# Altium schematic sheet Buffer.SchDoc
size A4
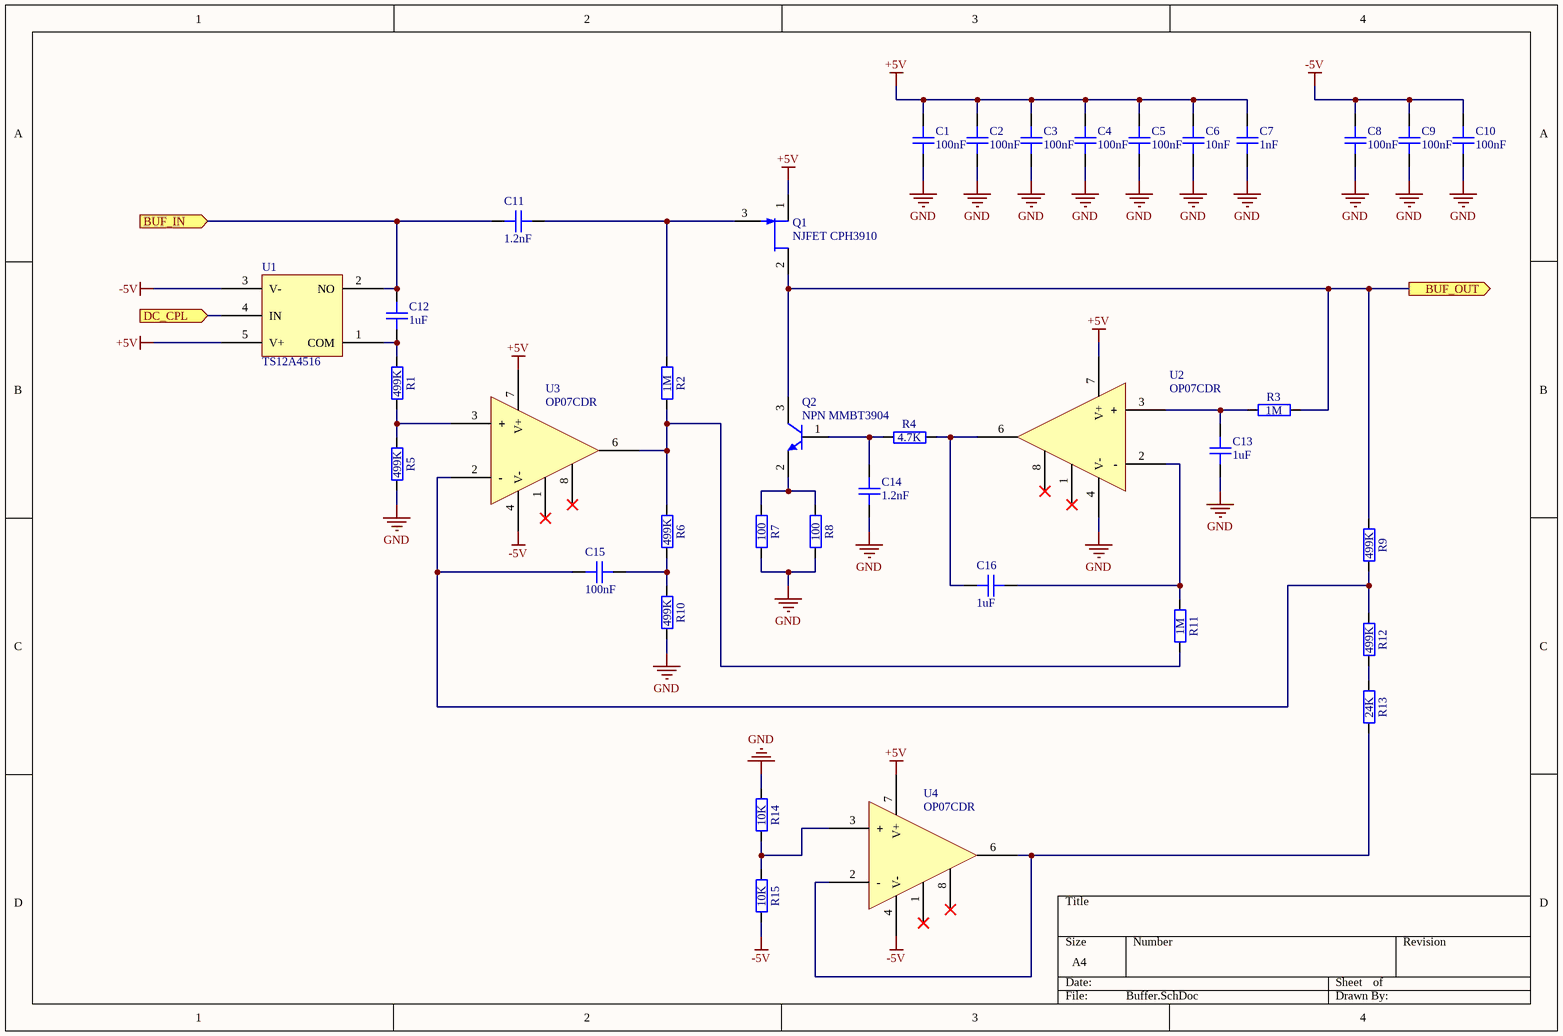
[diagram p0: Buffer.SchDoc]

## Parts
C1  value 100nF  [GEN_C_0402]  (hidden comment: CAP 100nF 16V X7R 0402)
C2  value 100nF  [GEN_C_0402]  (hidden comment: CAP 100nF 16V X7R 0402)
C3  value 100nF  [GEN_C_0402]  (hidden comment: CAP 100nF 16V X7R 0402)
C4  value 100nF  [GEN_C_0402]  (hidden comment: CAP 100nF 16V X7R 0402)
C5  value 100nF  [GEN_C_0402]  (hidden comment: CAP 100nF 16V X7R 0402)
C6  value 10nF  [GEN_C_0402]  (hidden comment: CAP 10nF 50V X7R 0402)
C7  value 1nF  [GEN_C_0402]  (hidden comment: CAP 1nF 50V X7R 0402)
C8  value 100nF  [GEN_C_0402]  (hidden comment: CAP 100nF 16V X7R 0402)
C9  value 100nF  [GEN_C_0402]  (hidden comment: CAP 100nF 16V X7R 0402)
C10  value 100nF  [GEN_C_0402]  (hidden comment: CAP 100nF 16V X7R 0402)
C11  1.2nF  [GEN_C_0603]
C12  value 1uF  [GEN_C_0402]  (hidden comment: CAP 1uF 25V X5R 0402)
C13  value 1uF  [GEN_C_0402]  (hidden comment: CAP 1uF 25V X5R 0402)
C14  1.2nF  [GEN_C_0603]
C15  value 100nF  [GEN_C_0402]  (hidden comment: CAP 100nF 16V X7R 0402)
C16  value 1uF  [GEN_C_0402]  (hidden comment: CAP 1uF 25V X5R 0402)
Q1  NJFET CPH3910  [ON_SOT23_CPH3]
Q2  NPN MMBT3904  [MMC_SOT23]
R1  value 499K  [GEN_R_0402]  (hidden comment: RES 499K OHM 1% 1/10W 0402)
R2  value 1M  [GEN_R_0402]  (hidden comment: RES 1M OHM 1% 1/10W 0402)
R3  value 1M  [GEN_R_0402]  (hidden comment: RES 1M OHM 1% 1/10W 0402)
R4  value 4.7K  [GEN_R_0402]  (hidden comment: RES 4.7K OHM 1% 1/10W 0402)
R5  value 499K  [GEN_R_0402]  (hidden comment: RES 499K OHM 1% 1/10W 0402)
R6  value 499K  [GEN_R_0402]  (hidden comment: RES 499K OHM 1% 1/10W 0402)
R7  value 100  [GEN_R_0402]  (hidden comment: RES 100 OHM 1% 1/10W 0402)
R8  value 100  [GEN_R_0402]  (hidden comment: RES 100 OHM 1% 1/10W 0402)
R9  value 499K  [GEN_R_0402]  (hidden comment: RES 499K OHM 1% 1/10W 0402)
R10  value 499K  [GEN_R_0402]  (hidden comment: RES 499K OHM 1% 1/10W 0402)
R11  value 1M  [GEN_R_0402]  (hidden comment: RES 1M OHM 1% 1/10W 0402)
R12  value 499K  [GEN_R_0402]  (hidden comment: RES 499K OHM 1% 1/10W 0402)
R13  value 24K  [GEN_R_0402]  (hidden comment: RES 24K OHM 1% 1/10W 0402)
R14  value 10K  [GEN_R_0402]  (hidden comment: RES 10K OHM 1% 1/10W 0402)
R15  value 10K  [GEN_R_0402]  (hidden comment: RES 10K OHM 1% 1/10W 0402)
U1  TS12A4516  [GEN_SOT23_5_950_2900X1600X1450]
U2  OP07CDR  [TI_SOIC8_D0008A]
U3  OP07CDR  [TI_SOIC8_D0008A]
U4  OP07CDR  [TI_SOIC8_D0008A]

## Ports
BUF_IN (in), BUF_OUT (out), DC_CPL (in)

## Nets
+5V: C1.1 C2.1 C3.1 C4.1 C5.1 C6.2 C7.2 Q1.1(S) U1.5(V+) U2.7(V+) U3.7(V+) U4.7(V+)
-5V: C8.1 C9.1 C10.1 R15.1 U1.3(V-) U3.4(V-) U4.4(V-)
GND: C1.2 C2.2 C3.2 C4.2 C5.2 C6.1 C7.1 C8.2 C9.2 C10.2 C13.1 C14.1 R5.1 R7.1 R8.1 R10.1 R14.2 U2.4(V-)
BUF_IN: C11.2 C12.2 U1.2(NO) ; port BUF_IN
BUF_OUT: Q1.2(D) Q2.3(C) R3.1 R9.2 ; port BUF_OUT
DC_CPL: U1.4(IN) ; port DC_CPL
NetC11_1: C11.1 Q1.3(G) R2.2
NetC12_1: C12.1 R1.2 U1.1(COM)
NetC13_2: C13.2 R3.2 U2.3(+)
NetC14_2: C14.2 Q2.1(B) R4.1
NetC15_1: C15.1 R6.1 R10.2
NetC15_2: C15.2 R9.1 R12.2 U3.2(-)
NetC16_1: C16.1 R11.2 U2.2(-)
NetC16_2: C16.2 R4.2 U2.6(OUT)
NetQ2_2: Q2.2(E) R7.2 R8.2
NetR1_1: R1.1 R5.2 U3.3(+)
NetR2_1: R2.1 R6.2 R11.1 U3.6(OUT)
NetR12_1: R12.1 R13.2
NetR13_1: R13.1 U4.2(-) U4.6(OUT)
NetR14_1: R14.1 R15.2 U4.3(+)

Not connected (* = marked no-connect by the designer): U2 1(N1)* 8(N2)*; U3 1(N1)* 8(N2)*; U4 1(N1)* 8(N2)*

## Library data of the parts
C11 C14 = CAP 1.2nF 50V C0G 0603: Voltage Rating: 50V; Temperature Coefficient: C0G; Package: 0603; Value: 1.2nF; Supplier 1: Digi-Key; Supplier Part Number 1: 490-1453-1-ND
R1 R5 R6 R9 R10 R12 = RES 499K OHM 1% 1/10W 0402: Power Rating: 0.1W; Tolerance: 1%; Package: 0402; Supplier 1: Digi-Key; Supplier Part Number 1: P499KLCT-ND
R2 R3 R11 = RES 1M OHM 1% 1/10W 0402: Power Rating: 0.1W; Tolerance: 1%; Package: 0402; Supplier 1: Digi-Key; Supplier Part Number 1: P1.00MLCT-ND
R4 = RES 4.7K OHM 1% 1/10W 0402: Power Rating: 0.1W; Tolerance: 1%; Package: 0402; Supplier 1: Digi-Key; Supplier Part Number 1: P4.70KLCT-ND
R7 R8 = RES 100 OHM 1% 1/10W 0402: Power Rating: 0.1W; Tolerance: 1%; Package: 0402; Supplier 1: Digi-Key; Supplier Part Number 1: P100LCT-ND
R13 = RES 24K OHM 1% 1/10W 0402: Power Rating: 0.1W; Tolerance: 1%; Package: 0402; Supplier 1: Digi-Key; Supplier Part Number 1: P24.0KLCT-ND
R14 R15 = RES 10K OHM 1% 1/10W 0402: Power Rating: 0.1W; Tolerance: 1%; Package: 0402; Supplier 1: Digi-Key; Supplier Part Number 1: P10.0KLCT-ND
U1 = IC SWITCH SPST TS12A4516DBVR: Supplier 1: Digi-Key; Supplier Part Number 1: 296-24269-1-ND
U2-U4 = IC OPAMP OP07CDR: Supplier 1: Digi-Key; Supplier Part Number 1: 296-14626-1-ND
C1-C5 C8-C10 C15 = CAP 100nF 16V X7R 0402: Package: 0402; Voltage Rating: 16V; Supplier 1: Digi-Key; Supplier Part Number 1: 490-4759-1-ND
C6 = CAP 10nF 50V X7R 0402: Package: 0402; Voltage Rating: 50V; Supplier 1: Digi-Key; Supplier Part Number 1: 490-4762-1-ND
C7 = CAP 1nF 50V X7R 0402: Package: 0402; Voltage Rating: 50V; Supplier 1: Digi-Key; Supplier Part Number 1: 490-4761-1-ND
C12 C13 C16 = CAP 1uF 25V X5R 0402: Package: 0402; Voltage Rating: 25V; Supplier 1: Digi-Key; Supplier Part Number 1: 490-10017-1-ND
Q1 = NJFET CPH3910: Supplier 1: Digi-Key; Supplier Part Number 1: CPH3910-TL-EOSCT-ND
Q2 = NPN MMBT3904: Supplier 1: Digi-Key; Supplier Part Number 1: MMBT3904TPMSCT-ND